# Altium schematic sheet Weatstone bridges part I.SchDoc: Weatstone bridges part I
size A4; Revision: 1; SheetNumber: 4; SheetTotal: 5
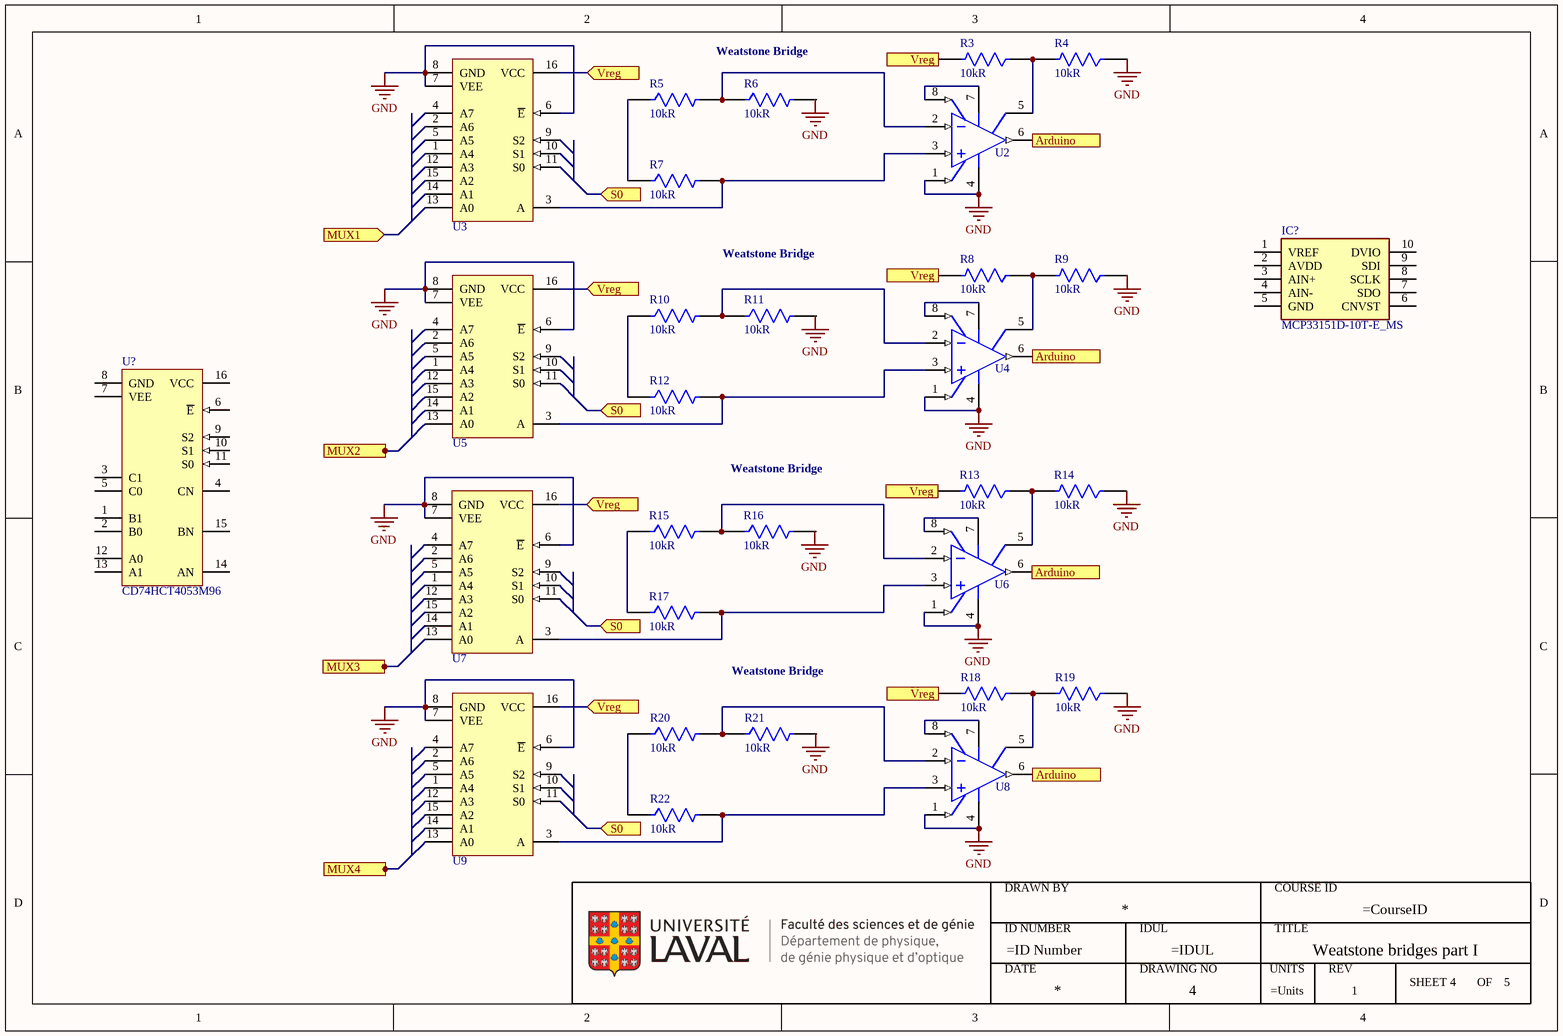
[diagram p0: Weatstone bridges part I.SchDoc]

## Parts
*3  ULaval FSG-DPGPO  (value not drawn)
IC?  MCP33151D-10T-E_MS  [SOP50P490X110-10N]
R3  value 10kR  [FP-RT0603-IPC_C]  (hidden comment: RT0603BRD0710KL)
R4  value 10kR  [FP-RT0603-IPC_C]  (hidden comment: RT0603BRD0710KL)
R5  value 10kR  [FP-RT0603-IPC_C]  (hidden comment: RT0603BRD0710KL)
R6  value 10kR  [FP-RT0603-IPC_C]  (hidden comment: RT0603BRD0710KL)
R7  value 10kR  [FP-RT0603-IPC_C]  (hidden comment: RT0603BRD0710KL)
R8  value 10kR  [FP-RT0603-IPC_C]  (hidden comment: RT0603BRD0710KL)
R9  value 10kR  [FP-RT0603-IPC_C]  (hidden comment: RT0603BRD0710KL)
R10  value 10kR  [FP-RT0603-IPC_C]  (hidden comment: RT0603BRD0710KL)
R11  value 10kR  [FP-RT0603-IPC_C]  (hidden comment: RT0603BRD0710KL)
R12  value 10kR  [FP-RT0603-IPC_C]  (hidden comment: RT0603BRD0710KL)
R13  value 10kR  [FP-RT0603-IPC_C]  (hidden comment: RT0603BRD0710KL)
R14  value 10kR  [FP-RT0603-IPC_C]  (hidden comment: RT0603BRD0710KL)
R15  value 10kR  [FP-RT0603-IPC_C]  (hidden comment: RT0603BRD0710KL)
R16  value 10kR  [FP-RT0603-IPC_C]  (hidden comment: RT0603BRD0710KL)
R17  value 10kR  [FP-RT0603-IPC_C]  (hidden comment: RT0603BRD0710KL)
R18  value 10kR  [FP-RT0603-IPC_C]  (hidden comment: RT0603BRD0710KL)
R19  value 10kR  [FP-RT0603-IPC_C]  (hidden comment: RT0603BRD0710KL)
R20  value 10kR  [FP-RT0603-IPC_C]  (hidden comment: RT0603BRD0710KL)
R21  value 10kR  [FP-RT0603-IPC_C]  (hidden comment: RT0603BRD0710KL)
R22  value 10kR  [FP-RT0603-IPC_C]  (hidden comment: RT0603BRD0710KL)
U2  MCP6N11-100E/SN  [SOIC-SN8_L]  (value not drawn)
U3  CD74HC4051M96  [D0016A_M]  (value not drawn)
U4  MCP6N11-100E/SN  [SOIC-SN8_L]  (value not drawn)
U5  CD74HC4051M96  [D0016A_M]  (value not drawn)
U6  MCP6N11-100E/SN  [SOIC-SN8_L]  (value not drawn)
U7  CD74HC4051M96  [D0016A_M]  (value not drawn)
U8  MCP6N11-100E/SN  [SOIC-SN8_L]  (value not drawn)
U9  CD74HC4051M96  [D0016A_M]  (value not drawn)
U?  CD74HCT4053M96  [D0016A_M]

## Ports
Arduino (out, see Weatstone bridges part I[3A], Weatstone bridges part I[3B], Weatstone bridges part I[3C], Weatstone bridges part II[3A], Weatstone bridges part II[3B], Weatstone bridges part II[3C]), Arduino (out, see Weatstone bridges part I[3A], Weatstone bridges part I[3B], Weatstone bridges part I[3D], Weatstone bridges part II[3A], Weatstone bridges part II[3B], Weatstone bridges part II[3C]), Arduino (out, see Weatstone bridges part I[3A], Weatstone bridges part I[3C], Weatstone bridges part I[3D], Weatstone bridges part II[3A], Weatstone bridges part II[3B], Weatstone bridges part II[3C]), Arduino (out, see Weatstone bridges part I[3B], Weatstone bridges part I[3C], Weatstone bridges part I[3D], Weatstone bridges part II[3A], Weatstone bridges part II[3B], Weatstone bridges part II[3C]), MUX1 (in, see Thermistors[1A], Weatstone bridges part II[1B]), MUX2 (in, see Thermistors[2A], Weatstone bridges part II[1B]), MUX3 (in, see Thermistors[3A], Weatstone bridges part II[1C]), MUX4 (in, see Thermistors[3A]), S0 (in, see Weatstone bridges part I[2A], Weatstone bridges part I[2B], Weatstone bridges part I[2C], Weatstone bridges part II[1A], Weatstone bridges part II[1B], Weatstone bridges part II[1C]), S0 (in, see Weatstone bridges part I[2A], Weatstone bridges part I[2B], Weatstone bridges part I[2D], Weatstone bridges part II[1A], Weatstone bridges part II[1B], Weatstone bridges part II[1C]), S0 (in, see Weatstone bridges part I[2A], Weatstone bridges part I[2C], Weatstone bridges part I[2D], Weatstone bridges part II[1A], Weatstone bridges part II[1B], Weatstone bridges part II[1C]), S0 (in, see Weatstone bridges part I[2B], Weatstone bridges part I[2C], Weatstone bridges part I[2D], Weatstone bridges part II[1A], Weatstone bridges part II[1B], Weatstone bridges part II[1C]), Vreg (in, see Power Supply Unit[3B], Weatstone bridges part I[2A], Weatstone bridges part I[2B], Weatstone bridges part I[2C], Weatstone bridges part I[3A], Weatstone bridges part I[3B], Weatstone bridges part I[3C], Weatstone bridges part II[1A], Weatstone bridges part II[1B], Weatstone bridges part II[1C], Weatstone bridges part II[2A], Weatstone bridges part II[2B], Weatstone bridges part II[2C]), Vreg (in, see Power Supply Unit[3B], Weatstone bridges part I[2A], Weatstone bridges part I[2B], Weatstone bridges part I[2C], Weatstone bridges part I[3A], Weatstone bridges part I[3B], Weatstone bridges part II[1A], Weatstone bridges part II[1B], Weatstone bridges part II[1C], Weatstone bridges part II[2A], Weatstone bridges part II[2B], Weatstone bridges part II[2C]), Vreg (in, see Power Supply Unit[3B], Weatstone bridges part I[2A], Weatstone bridges part I[2B], Weatstone bridges part I[2C], Weatstone bridges part I[3B], Weatstone bridges part I[3C], Weatstone bridges part II[1A], Weatstone bridges part II[1B], Weatstone bridges part II[1C], Weatstone bridges part II[2A], Weatstone bridges part II[2B], Weatstone bridges part II[2C]), Vreg (in, see Power Supply Unit[3B], Weatstone bridges part I[2A], Weatstone bridges part I[2B], Weatstone bridges part I[3A], Weatstone bridges part I[3B], Weatstone bridges part I[3C], Weatstone bridges part II[1A], Weatstone bridges part II[1B], Weatstone bridges part II[1C], Weatstone bridges part II[2A], Weatstone bridges part II[2B], Weatstone bridges part II[2C]), Vreg (in, see Power Supply Unit[3B], Weatstone bridges part I[2B], Weatstone bridges part I[2C], Weatstone bridges part I[3A], Weatstone bridges part I[3B], Weatstone bridges part I[3C], Weatstone bridges part II[1A], Weatstone bridges part II[1B], Weatstone bridges part II[1C], Weatstone bridges part II[2A], Weatstone bridges part II[2B], Weatstone bridges part II[2C])

## Nets
GND: R4.1 R9.1 R14.1 R19.1 U2.1(VFG) U2.4(VSS) U3.6(~{E}) U3.7(VEE) U3.8(GND) U4.1(VFG) U4.4(VSS) U5.6(~{E}) U5.7(VEE) U5.8(GND) U6.1(VFG) U6.4(VSS) U7.6(~{E}) U7.7(VEE) U7.8(GND) U8.1(VFG) U8.4(VSS) U9.6(~{E}) U9.7(VEE) U9.8(GND)
Arduino: U2.6(VOUT) U4.6(VOUT) U6.6(VOUT) U8.6(VOUT) ; port Arduino
Vreg: R3.2 R8.2 R13.2 R18.2 U3.16(VCC) U5.16(VCC) U7.16(VCC) U9.16(VCC) ; port Vreg
NetR3_1: R3.1 R4.2 U2.5(VREF)
NetR5_1: R5.1 R7.1
NetR5_2: R5.2 R6.1 U2.2(VIM)
NetR7_2: R7.2 U2.3(VIP) U3.3(A)
NetR8_1: R8.1 R9.2 U4.5(VREF)
NetR10_1: R10.1 R12.1
NetR10_2: R10.2 R11.1 U4.2(VIM)
NetR12_2: R12.2 U4.3(VIP) U5.3(A)
NetR13_1: R13.1 R14.2 U6.5(VREF)
NetR15_1: R15.1 R17.1
NetR15_2: R15.2 R16.1 U6.2(VIM)
NetR17_2: R17.2 U6.3(VIP) U7.3(A)
NetR18_1: R18.1 R19.2 U8.5(VREF)
NetR20_1: R20.1 R22.1
NetR20_2: R20.2 R21.1 U8.2(VIM)
NetR22_2: R22.2 U8.3(VIP) U9.3(A)
NetU2_7: U2.7(VDD) U2.8(EN/~{CAL})
NetU4_7: U4.7(VDD) U4.8(EN/~{CAL})
NetU6_7: U6.7(VDD) U6.8(EN/~{CAL})
NetU8_7: U8.7(VDD) U8.8(EN/~{CAL})

Not connected (* = marked no-connect by the designer): IC? 1(VREF) 2(AVDD) 3(AIN+) 4(AIN-) 5(GND) 6(CNVST) 7(SDO) 8(SCLK) 9(SDI) 10(DVIO); R6 2; R11 2; R16 2; R21 2; U3 1(A4) 2(A6) 4(A7) 5(A5) 9(S2) 10(S1) 11(S0) 12(A3) 13(A0) 14(A1) 15(A2); U5 1(A4) 2(A6) 4(A7) 5(A5) 9(S2) 10(S1) 11(S0) 12(A3) 13(A0) 14(A1) 15(A2); U7 1(A4) 2(A6) 4(A7) 5(A5) 9(S2) 10(S1) 11(S0) 12(A3) 13(A0) 14(A1) 15(A2); U9 1(A4) 2(A6) 4(A7) 5(A5) 9(S2) 10(S1) 11(S0) 12(A3) 13(A0) 14(A1) 15(A2); U? 1(B1) 2(B0) 3(C1) 4(CN) 5(C0) 6(~{E}) 7(VEE) 8(GND) 9(S2) 10(S1) 11(S0) 12(A0) 13(A1) 14(AN) 15(BN) 16(VCC)

## Notes on the sheet
- Weatstone Bridge
- Labels drawn without touching a wire or pin: GND
- (in symbol ULaval FSG-DPGPO) DRAWN BY; COURSE ID; ID NUMBER; IDUL; TITLE; DATE; DRAWING NO; UNITS; REV; SHEET; OF

## Library data of the parts
IC? = MCP33151D-10T-E_MS: Integrated Circuit; Manufacturer_Name: Microchip; Manufacturer_Part_Number: MCP33151D-10T-E/MS; Datasheet Link: https://ww1.microchip.com/downloads/en/DeviceDoc/20006219A.pdf; Height: 1.1mm; Mouser Part Number: 579-P33151D-10T-E/MS; Mouser Price/Stock: https://www.mouser.co.uk/ProductDetail/Microchip-Technology/MCP33151D-10T-E-MS?qs=T3oQrply3y%2FfmXKpp8bcAQ%3D%3D
R3-R22 = CMP-009-00178-1: Res High precision Thin Film 0603 10K Ohm 0.1% 1/10W ±25ppm/°C Molded SMD Paper T/R; Max Power Dissipation: 100mW; Working Voltage: 75V; RoHS Compliant: Yes; Power Rating: 100mW; Lead Free: Lead Free; Depth: 0.8mm; Case Code (Imperial): 0603; Max Operating Temperature: 155°C; Voltage Rating: 75V; Package Quantity: 5000; Packaging: Tape and Reel; Case/Package: 0603; Height: 0.022inch; Construction: Rectangular; Min Operating Temperature: -55°C; Termination: SMD/SMT; Features: Moisture Resistant; Number of Terminations: 2; Case Code (Metric): 1608; Technology: THIN FILM; Military Standard: Not; Length: 0.063inch; Voltage Rating (DC): 75V; Temperature Coefficient: 25ppm/°C; Weight: 7.1E-05oz; Width: 0.8mm; Series: RT; Resistor Type: Thin Film
U2 U4 U6 U8 = CMP-014-00010-1: MCP6N11 Series Single Channel 500 KHz 5.5 V Instrumentation Amplifier - SOIC-8; Bandwidth: 500kHz; Min Supply Voltage: 1.8V; Number of Elements: 2; Gain Bandwidth Product: 35MHz; Input Offset Voltage (Vos): 350uV; Number of Channels: 1; Nominal Supply Current: 800uA; Common Mode Rejection Ratio: 86dB; Slew Rate: 6V/µs; Max Supply Voltage: 5.5V; Slew Rate-Nom: 9V/µs; Input Bias Current: 10pA; Mounting Technology: Surface Mount; Package Quantity: 100; Pins: 8; Width: 3.9mm; Length: 4.9mm; Case/Package: SOIC; Min Operating Temperature: -40°C; Radiation Hardening: No; RoHS Compliant: Yes; Unity Gain Bandwidth Product: 35MHz; Lead Free: Lead Free; Number of Amplifiers: 1; Max Operating Temperature: 125°C; Height: 1.25mm; Packaging: Rail/Tube; Input Offset Voltage-Max: 350uV; Reach SVHC Compliant: Yes; Supply Current: 800uA; Max Supply Current: 800uA; Power Supply Rejection Ratio (PSRR): 86dB; Number of Circuits: 1
U3 U5 U7 U9 = CMP-1575-00036-4: High Speed CMOS 8-Channel Analog Multiplexer/Demultiplexer, D0016A, LARGE T&R; Manufacturer: Texas Instruments; Crosstalk: Yes; Ron(Max)(Ohms): 130; VCC(Min)(V): 2; Bandwidth(Max)(MHz): 180; VCC(Max)(V): 6; Rating: Catalog; Configuration: 1 X 1：8 MUX; Ron(Typ)(Ohms): 45; Generic Part Number: CD74HC4051; Output Type: CMOS; Operating Temperature Range(C): -55 to 125; DatasheetVersion: SCHS122J; Code_JEDEC: MS-012 variation AC; PackageReference: D0016A; PackageVersion: http://www.ti.com/lit/ml/mpds178g/mpds178g.pdf
U? = CMP-1575-00016-3: High Speed CMOS Triple 2-Channel Analog Multiplexer/Demultiplexer with TTL inputs, D0016A, LARGE T&R; Manufacturer: Texas Instruments; Ron(Typ)(Ohms): 45; VCC(Max)(V): 5.5; Configuration: 3 X SPDT; VCC(Min)(V): 4.5; Crosstalk: Yes; Ron(Max)(Ohms): 130; Bandwidth(Max)(MHz): 200; Rating: Catalog; Operating Temperature Range(C): -55 to 125; PackageVersion: http://www.ti.com/lit/ml/mpds178g/mpds178g.pdf; PackageReference: D0016A; Output Type: CMOS; Generic Part Number: CD74HCT4053; DatasheetVersion: SCHS122J; Code_JEDEC: MS-012 variation AC